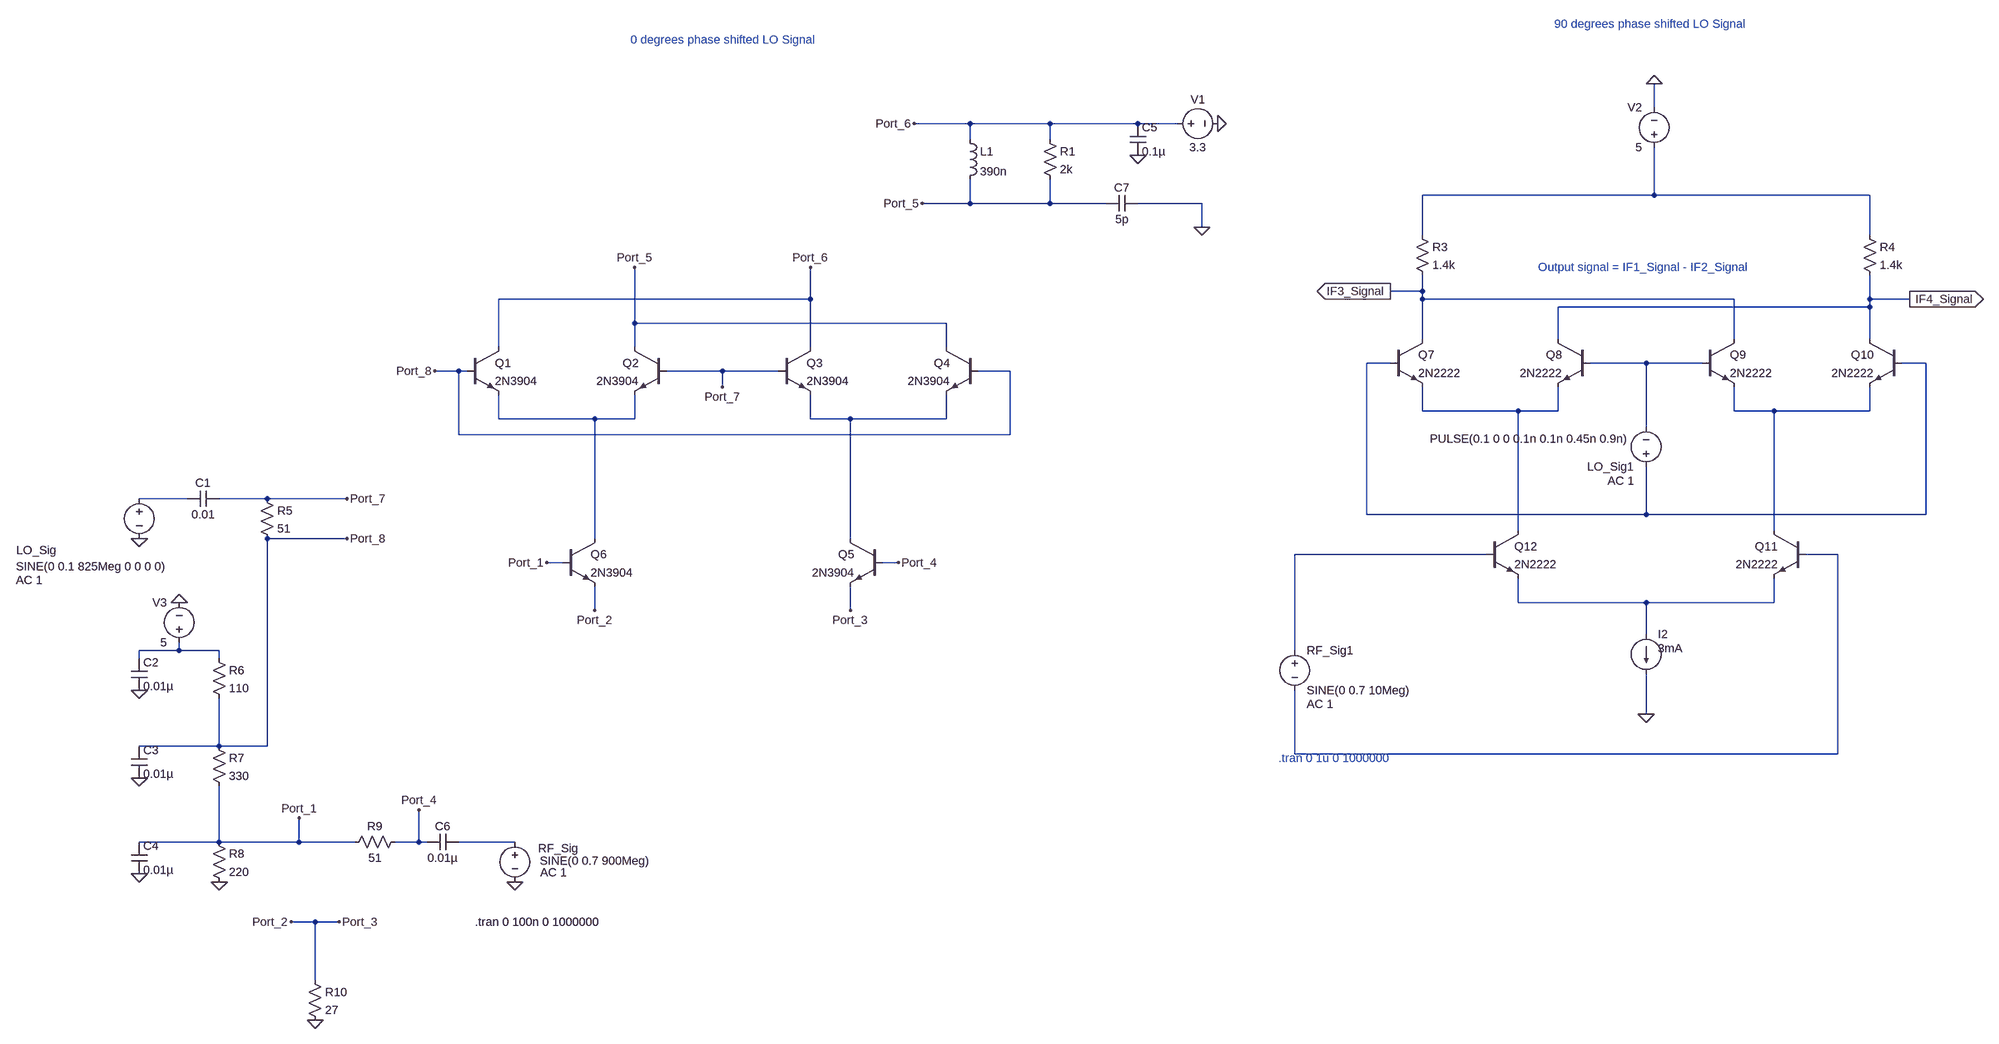
[diagram p0: schematic Double Balanced Gilbert Cell Mixer [HFA MODELLING].asc]
Double Balanced Gilbert Cell Mixer [HFA MODELLING].asc, the LTspice schematic file:
Version 4
SHEET 1 4728 1348
WIRE 4032 -528 4032 -576
WIRE 1024 -496 912 -496
WIRE 1184 -496 1024 -496
WIRE 1360 -496 1184 -496
WIRE 1440 -496 1360 -496
WIRE 1024 -464 1024 -496
WIRE 1184 -464 1184 -496
WIRE 4032 -352 4032 -448
WIRE 4032 -352 3568 -352
WIRE 4464 -352 4032 -352
WIRE 1024 -336 1024 -384
WIRE 1024 -336 928 -336
WIRE 1184 -336 1184 -384
WIRE 1184 -336 1024 -336
WIRE 1296 -336 1184 -336
WIRE 1488 -336 1360 -336
WIRE 1488 -288 1488 -336
WIRE 3568 -272 3568 -352
WIRE 4464 -272 4464 -352
WIRE 3568 -160 3568 -192
WIRE 3568 -160 3504 -160
WIRE 704 -144 704 -208
WIRE 704 -144 80 -144
WIRE 3568 -144 3568 -160
WIRE 4192 -144 3568 -144
WIRE 4464 -144 4464 -192
WIRE 4544 -144 4464 -144
WIRE 4464 -128 4464 -144
WIRE 4464 -128 3840 -128
WIRE 352 -96 352 -208
WIRE 976 -96 352 -96
WIRE 3568 -64 3568 -144
WIRE 3840 -64 3840 -128
WIRE 4192 -64 4192 -144
WIRE 4464 -64 4464 -128
WIRE 80 -48 80 -144
WIRE 352 -48 352 -96
WIRE 704 -48 704 -144
WIRE 976 -48 976 -96
WIRE 3504 -16 3456 -16
WIRE 4016 -16 3904 -16
WIRE 4128 -16 4016 -16
WIRE 4576 -16 4528 -16
WIRE 0 0 -48 0
WIRE 16 0 0 0
WIRE 528 0 416 0
WIRE 640 0 528 0
WIRE 1104 0 1040 0
WIRE 528 32 528 0
WIRE 3568 80 3568 32
WIRE 3760 80 3568 80
WIRE 3840 80 3840 32
WIRE 3840 80 3760 80
WIRE 4192 80 4192 32
WIRE 4272 80 4192 80
WIRE 4464 80 4464 32
WIRE 4464 80 4272 80
WIRE 80 96 80 48
WIRE 272 96 80 96
WIRE 352 96 352 48
WIRE 352 96 272 96
WIRE 704 96 704 48
WIRE 784 96 704 96
WIRE 976 96 976 48
WIRE 976 96 784 96
WIRE 4016 112 4016 -16
WIRE 0 128 0 0
WIRE 1104 128 1104 0
WIRE 1104 128 0 128
WIRE -544 256 -640 256
WIRE -384 256 -480 256
WIRE -224 256 -384 256
WIRE 3456 288 3456 -16
WIRE 4016 288 4016 192
WIRE 4016 288 3456 288
WIRE 4576 288 4576 -16
WIRE 4576 288 4016 288
WIRE 3760 320 3760 80
WIRE 4272 320 4272 80
WIRE -224 336 -384 336
WIRE 272 336 272 96
WIRE 784 336 784 96
WIRE 3696 368 3312 368
WIRE 4400 368 4336 368
WIRE 208 384 176 384
WIRE 880 384 848 384
WIRE 3760 464 3760 416
WIRE 4016 464 3760 464
WIRE 4272 464 4272 416
WIRE 4272 464 4016 464
WIRE 272 480 272 432
WIRE 784 480 784 432
WIRE 4016 528 4016 464
WIRE -560 560 -560 544
WIRE -560 560 -640 560
WIRE -480 560 -560 560
WIRE 3312 560 3312 368
WIRE -640 576 -640 560
WIRE -480 576 -480 560
WIRE 4016 688 4016 608
WIRE -480 752 -480 656
WIRE -480 752 -640 752
WIRE -384 752 -384 336
WIRE -384 752 -480 752
WIRE 3312 768 3312 640
WIRE 4400 768 4400 368
WIRE 4400 768 3312 768
WIRE -480 944 -480 832
WIRE -480 944 -640 944
WIRE -320 944 -320 896
WIRE -320 944 -480 944
WIRE -208 944 -320 944
WIRE -80 944 -80 880
WIRE -80 944 -128 944
WIRE -64 944 -80 944
WIRE 112 944 0 944
WIRE -288 1104 -336 1104
WIRE -240 1104 -288 1104
WIRE -288 1248 -288 1104
FLAG 4016 688 0
FLAG 4032 -576 0
FLAG 3504 -160 IF3_Signal
IOPIN 3504 -160 Out
FLAG 4544 -144 IF4_Signal
IOPIN 4544 -144 Out
FLAG 112 1024 0
FLAG -640 336 0
FLAG -224 256 Port_7
FLAG 528 32 Port_7
FLAG -224 336 Port_8
FLAG -48 0 Port_8
FLAG -560 464 0
FLAG -640 640 0
FLAG -640 816 0
FLAG -640 1008 0
FLAG -480 1024 0
FLAG -288 1328 0
FLAG -336 1104 Port_2
FLAG -240 1104 Port_3
FLAG -80 880 Port_4
FLAG 272 480 Port_2
FLAG 784 480 Port_3
FLAG -320 896 Port_1
FLAG 176 384 Port_1
FLAG 880 384 Port_4
FLAG 1360 -432 0
FLAG 1520 -496 0
FLAG 1488 -288 0
FLAG 352 -208 Port_5
FLAG 704 -208 Port_6
FLAG 912 -496 Port_6
FLAG 928 -336 Port_5
SYMBOL npn 16 -48 R0
SYMATTR InstName Q1
SYMATTR Value 2N3904
SYMBOL npn 416 -48 M0
SYMATTR InstName Q2
SYMATTR Value 2N3904
SYMBOL npn 640 -48 R0
SYMATTR InstName Q3
SYMATTR Value 2N3904
SYMBOL npn 1040 -48 M0
SYMATTR InstName Q4
SYMATTR Value 2N3904
SYMBOL npn 848 336 M0
SYMATTR InstName Q5
SYMATTR Value 2N3904
SYMBOL npn 208 336 R0
SYMATTR InstName Q6
SYMATTR Value 2N3904
SYMBOL voltage -640 240 R0
WINDOW 3 -247 152 Left 2
WINDOW 123 -247 179 Left 2
WINDOW 39 -243 179 Left 2
WINDOW 0 -246 119 Left 2
SYMATTR Value SINE(0 0.1 825Meg 0 0 0 0)
SYMATTR Value2 AC 1
SYMATTR InstName LO_Sig
SYMBOL voltage 112 928 R0
WINDOW 123 51 77 Left 2
WINDOW 39 24 152 Left 2
WINDOW 0 47 29 Left 2
WINDOW 3 50 54 Left 2
SYMATTR Value2 AC 1
SYMATTR InstName RF_Sig
SYMATTR Value SINE(0 0.7 900Meg)
SYMBOL npn 3504 -64 R0
SYMATTR InstName Q7
SYMATTR Value 2N2222
SYMBOL npn 3904 -64 M0
SYMATTR InstName Q8
SYMATTR Value 2N2222
SYMBOL npn 4128 -64 R0
SYMATTR InstName Q9
SYMATTR Value 2N2222
SYMBOL npn 4528 -64 M0
SYMATTR InstName Q10
SYMATTR Value 2N2222
SYMBOL npn 4336 320 M0
SYMATTR InstName Q11
SYMATTR Value 2N2222
SYMBOL npn 3696 320 R0
SYMATTR InstName Q12
SYMATTR Value 2N2222
SYMBOL res 3552 -288 R0
SYMATTR InstName R3
SYMATTR Value 1.4k
SYMBOL res 4448 -288 R0
SYMATTR InstName R4
SYMATTR Value 1.4k
SYMBOL voltage 4016 208 R180
WINDOW 3 35 72 Left 2
WINDOW 123 24 -12 Left 2
WINDOW 39 0 0 Left 0
SYMATTR Value PULSE(0.1 0 0 0.1n 0.1n 0.45n 0.9n)
SYMATTR Value2 AC 1
SYMATTR InstName LO_Sig1
SYMBOL voltage 3312 544 R0
WINDOW 123 24 124 Left 2
WINDOW 39 0 0 Left 0
SYMATTR Value2 AC 1
SYMATTR InstName RF_Sig1
SYMATTR Value SINE(0 0.7 10Meg)
SYMBOL voltage 4032 -432 R180
WINDOW 0 24 96 Left 2
WINDOW 3 24 16 Left 2
WINDOW 123 0 0 Left 0
WINDOW 39 0 0 Left 0
SYMATTR InstName V2
SYMATTR Value 5
SYMBOL current 4016 528 R0
WINDOW 123 0 0 Left 0
WINDOW 39 0 0 Left 0
WINDOW 3 24 28 Left 2
SYMATTR Value 3mA
SYMATTR InstName I2
SYMBOL cap -480 240 R90
WINDOW 0 0 32 VBottom 2
WINDOW 3 32 32 VTop 2
SYMATTR InstName C1
SYMATTR Value 0.01
SYMBOL res -400 240 R0
SYMATTR InstName R5
SYMATTR Value 51
SYMBOL voltage -560 560 R180
WINDOW 0 24 96 Left 2
WINDOW 3 24 16 Left 2
WINDOW 123 0 0 Left 0
WINDOW 39 0 0 Left 0
SYMATTR InstName V3
SYMATTR Value 5
SYMBOL cap -656 576 R0
SYMATTR InstName C2
SYMATTR Value 0.01µ
SYMBOL res -496 560 R0
SYMATTR InstName R6
SYMATTR Value 110
SYMBOL cap -656 752 R0
SYMATTR InstName C3
SYMATTR Value 0.01µ
SYMBOL res -496 736 R0
SYMATTR InstName R7
SYMATTR Value 330
SYMBOL cap -656 944 R0
SYMATTR InstName C4
SYMATTR Value 0.01µ
SYMBOL res -496 928 R0
SYMATTR InstName R8
SYMATTR Value 220
SYMBOL res -112 928 R90
WINDOW 0 0 56 VBottom 2
WINDOW 3 32 56 VTop 2
SYMATTR InstName R9
SYMATTR Value 51
SYMBOL cap 0 928 R90
WINDOW 0 0 32 VBottom 2
WINDOW 3 32 32 VTop 2
SYMATTR InstName C6
SYMATTR Value 0.01µ
SYMBOL res -304 1232 R0
SYMATTR InstName R10
SYMATTR Value 27
SYMBOL ind 1008 -480 R0
SYMATTR InstName L1
SYMATTR Value 390n
SYMBOL res 1168 -480 R0
SYMATTR InstName R1
SYMATTR Value 2k
SYMBOL cap 1344 -496 R0
SYMATTR InstName C5
SYMATTR Value 0.1µ
SYMBOL voltage 1424 -496 R270
WINDOW 0 32 56 VTop 2
WINDOW 3 -32 56 VBottom 2
WINDOW 123 0 0 Left 0
WINDOW 39 0 0 Left 0
SYMATTR InstName V1
SYMATTR Value 3.3
SYMBOL cap 1360 -352 R90
WINDOW 0 0 32 VBottom 2
WINDOW 3 32 32 VTop 2
SYMATTR InstName C7
SYMATTR Value 5p
TEXT 32 1104 Left 2 !.tran 0 100n 0 1000000
TEXT 3280 776 Left 2 ;.tran 0 1u 0 1000000
TEXT 3800 -208 Left 2 ;Output signal = IF1_Signal - IF2_Signal
TEXT 344 -664 Left 2 ;0 degrees phase shifted LO Signal
TEXT 3832 -696 Left 2 ;90 degrees phase shifted LO Signal

The netlist it stands for:
* Double Balanced Gilbert Cell Mixer [HFA MODELLING].asc
Q1 Port_6 Port_8 N006 0 2N3904
Q2 Port_5 Port_7 N006 0 2N3904
Q3 Port_6 Port_7 N007 0 2N3904
Q4 Port_5 Port_8 N007 0 2N3904
Q5 N007 Port_4 Port_3 0 2N3904
Q6 N006 Port_1 Port_3 0 2N3904
V§LO_Sig N008 0 SINE(0 0.1 825Meg 0 0 0 0) AC 1
V§RF_Sig N013 0 SINE(0 0.7 900Meg) AC 1
Q7 IF3_Signal N002 N004 0 2N2222
Q8 IF4_Signal N003 N004 0 2N2222
Q9 IF3_Signal N003 N005 0 2N2222
Q10 IF4_Signal N002 N005 0 2N2222
Q11 N005 N010 N011 0 2N2222
Q12 N004 N009 N011 0 2N2222
R3 N001 IF3_Signal 1.4k
R4 N001 IF4_Signal 1.4k
V§LO_Sig1 N002 N003 PULSE(0.1 0 0 0.1n 0.1n 0.45n 0.9n) AC 1
V§RF_Sig1 N009 N010 SINE(0 0.7 10Meg) AC 1
V2 N001 0 5
I2 N011 0 3mA
C1 Port_7 N008 0.01
R5 Port_7 Port_8 51
V3 N012 0 5
C2 N012 0 0.01µ
R6 N012 Port_8 110
C3 Port_8 0 0.01µ
R7 Port_8 Port_1 330
C4 Port_1 0 0.01µ
R8 Port_1 0 220
R9 Port_4 Port_1 51
C6 N013 Port_4 0.01µ
R10 Port_3 0 27
L1 Port_6 Port_5 390n
R1 Port_6 Port_5 2k
C5 Port_6 0 0.1µ
V1 Port_6 0 3.3
C7 0 Port_5 5p
.model NPN NPN
.model PNP PNP
.lib standard.bjt
.tran 0 100n 0 1000000
* .tran 0 1u 0 1000000
* Output signal = IF1_Signal - IF2_Signal
* 0 degrees phase shifted LO Signal
* 90 degrees phase shifted LO Signal
.backanno
.end